# Altium project UCC 28180 PFC-V02.PrjPcb (part 2 of 2)
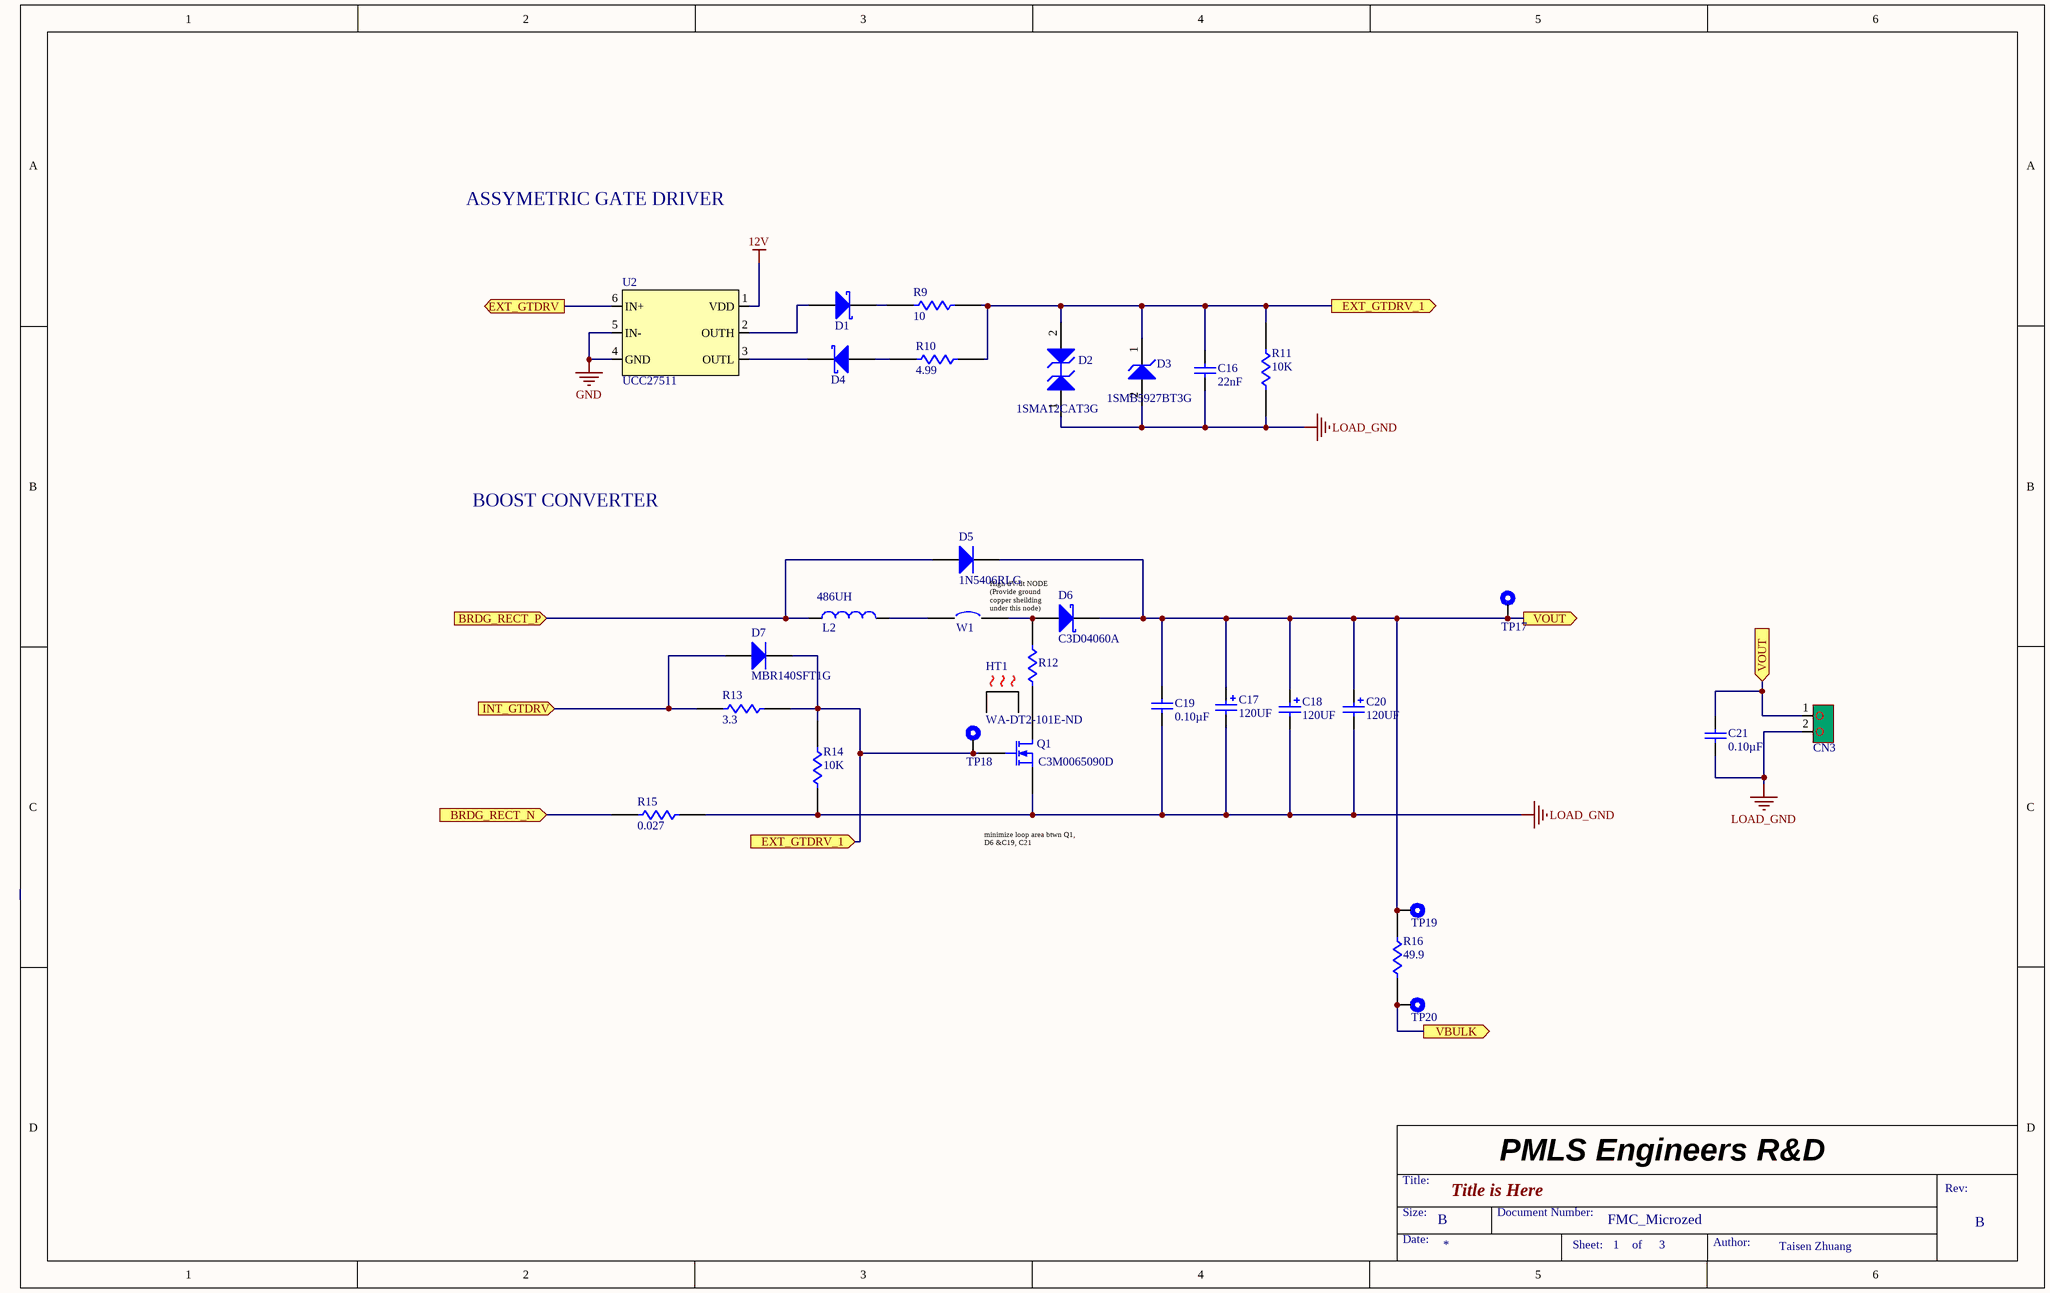
[diagram p3: UCC28180-3-V02.SchDoc]

## Nets that join several sheets
12V: UCC28180-2-V02 (6 pins), UCC28180-3-V02 (U2.1)
GND: UCC28180-2-V02 (15 pins), UCC28180-3-V02 (15 pins)
NetBR1_1: UCC 28180-1-V02 (BR1.1 C3.2 TP1.1), UCC28180-3-V02 (D5.1 L2.1)
NetBR1_4: UCC 28180-1-V02 (BR1.4 C3.1 TP2.1), UCC28180-2-V02 (R8.1), UCC28180-3-V02 (R15.2)
NetJ1_2: UCC28180-2-V02 (J1.2), UCC28180-3-V02 (U2.6)
NetR4_1: UCC28180-2-V02 (R4.1), UCC28180-3-V02 (R16.2 TP20.1)